# Altium schematic sheet AdControl.SchDoc: AdControl
size OrCAD B; Revision: V0.1; SheetNumber: 1; SheetTotal: 1; Email: qanpan.lo@gmail.com
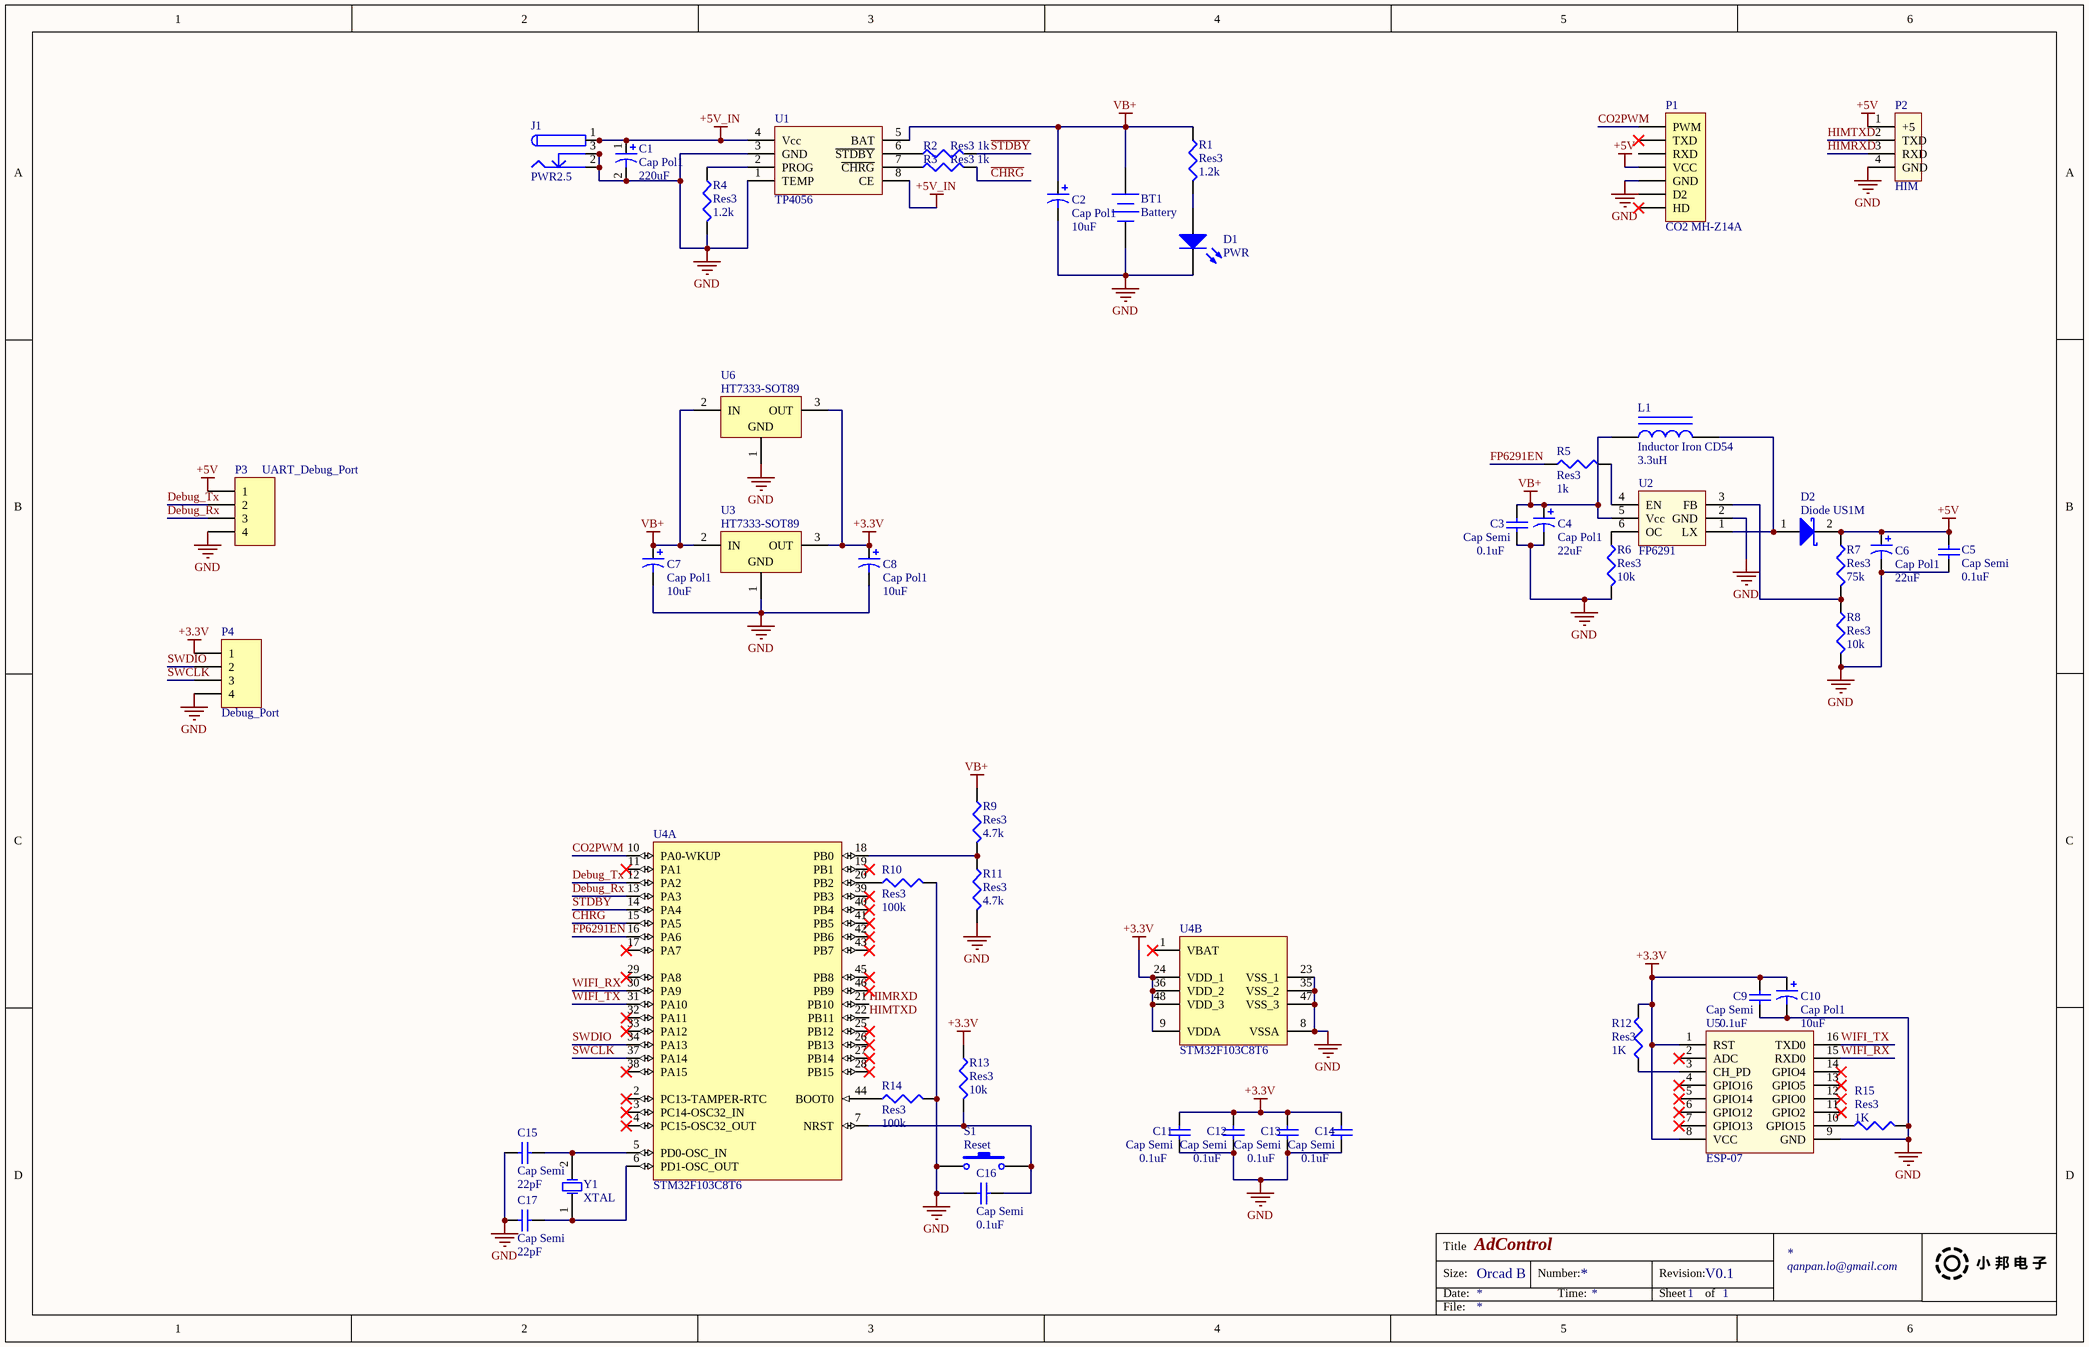
[diagram p0: AdControl.SchDoc]

## Parts
BT1  Battery  [KF3.96_2P]
C1  Cap Pol1  value 220uF  [CAP_6.3*5.4MM]
C2  Cap Pol1  value 10uF  [Cap_5*4mm]
C3  Cap Semi  value 0.1uF  [6-0805_N]
C4  Cap Pol1  value 22uF  [Cap_5*4mm]
C5  Cap Semi  value 0.1uF  [6-0805_N]
C6  Cap Pol1  value 22uF  [Cap_5*4mm]
C7  Cap Pol1  value 10uF  [Cap_5*4mm]
C8  Cap Pol1  value 10uF  [Cap_5*4mm]
C9  Cap Semi  value 0.1uF  [6-0805_N]
C10  Cap Pol1  value 10uF  [Cap_5*4mm]
C11  Cap Semi  value 0.1uF  [6-0805_N]
C12  Cap Semi  value 0.1uF  [6-0805_N]
C13  Cap Semi  value 0.1uF  [6-0805_N]
C14  Cap Semi  value 0.1uF  [6-0805_N]
C15  Cap Semi  value 22pF  [6-0805_N]
C16  Cap Semi  value 0.1uF  [6-0805_N]
C17  Cap Semi  value 22pF  [6-0805_N]
D1  PWR  [6-0805_N]
D2  Diode US1M  [US1M]
J1  PWR2.5  [KLD-3.5-1.3mm]
L1  Inductor Iron CD54  value 3.3uH  [CD54_Inductor]
P1  CO2 MH-Z14A  [1.25Connector]
P2  HIM  [XH2.54-4P]
P3  UART_Debug_Port  [HDR1X4]
P4  Debug_Port  [HDR1X4]
R1  Res3  value 1.2k  [6-0805_N]
R2  Res3  value 1k  [6-0805_N]
R3  Res3  value 1k  [6-0805_N]
R4  Res3  value 1.2k  [6-0805_N]
R5  Res3  value 1k  [6-0805_N]
R6  Res3  value 10k  [6-0805_N]
R7  Res3  value 75k  [6-0805_N]
R8  Res3  value 10k  [6-0805_N]
R9  Res3  value 4.7k  [6-0805_N]
R10  Res3  value 100k  [6-0805_N]
R11  Res3  value 4.7k  [6-0805_N]
R12  Res3  value 1K  [6-0805_N]
R13  Res3  value 10k  [6-0805_N]
R14  Res3  value 100k  [6-0805_N]
R15  Res3  value 1K  [6-0805_N]
S1  Reset  [SWP_PB_6.5mm]
U1  TP4056  [Power_SOP8]
U2  FP6291  [SOT23-6L]
U3  HT7333-SOT89  [SOT89_N]
U4  STM32F103C8T6  [STM-LQFP48_L]  (parts A,B of 2)
U5  ESP-07  [ESP-07_Wifi]
U6  HT7333-SOT89  [SOT89_N]
Y1  XTAL  [OSC_5032_2Pin]

## Nets
+3.3V: C8.1 C9.1 C10.1 C11.1 C12.1 C13.1 C14.1 P4.1 R12.2 R13.1 U3.3(OUT) U4.9(VDDA) U4.24(VDD_1) U4.36(VDD_2) U4.48(VDD_3) U5.1(RST) U5.8(VCC) U6.3(OUT)
+5V: C5.1 C6.1 D2.2(K) P1.4(VCC) P2.1(+5) P3.1 R7.1
+5V_IN: C1.1 J1.1 J1.1A J1.1B U1.4(Vcc) U1.8(CE)
GND: BT1.2(-) C1.2 C2.2 C3.2 C4.2 C5.2 C6.2 C7.2 C8.2 C9.2 C10.2 C11.2 C12.2 C13.2 C14.2 C15.2 C16.1 C17.2 D1.2(K) J1.2 J1.2A J1.2B J1.3 J1.3A J1.3B P1.5(GND) P2.4(GND) P3.4 P4.4 R4.2 R6.2 R8.2 R10.2 R11.2 R14.2 R15.2 S1.1 U1.1(TEMP) U1.3(GND) U2.2(GND) U3.1(GND) U4.8(VSSA) U4.23(VSS_1) U4.35(VSS_2) U4.47(VSS_3) U5.9(GND) U6.1(GND)
VB+: BT1.1(+) C2.1 C3.1 C4.1 C7.1 L1.1 R1.1 R9.1 U1.5(BAT) U2.5(Vcc) U3.2(IN) U6.2(IN)
~{CHRG}: R3.2 U4.15(PA5)
CO2PWM: P1.1(PWM) U4.10(PA0-WKUP)
Debug_Rx: P3.3 U4.13(PA3)
Debug_Tx: P3.2 U4.12(PA2)
FP6291EN: R5.1 U4.16(PA6)
HIMRXD: P2.3(RXD) U4.21(PB10)
HIMTXD: P2.2(TXD) U4.22(PB11)
~{STDBY}: R2.2 U4.14(PA4)
SWCLK: P4.3 U4.37(PA14)
SWDIO: P4.2 U4.34(PA13)
WIFI_RX: U4.30(PA9) U5.15(RXD0)
WIFI_TX: U4.31(PA10) U5.16(TXD0)
NetC15_1: C15.1 U4.5(PD0-OSC_IN) Y1.2(OSC2)
NetC16_2: C16.2 R13.2 S1.2 U4.7(NRST)
NetC17_1: C17.1 U4.6(PD1-OSC_OUT) Y1.1(OSC1)
NetD1_1: D1.1(A) R1.2
NetD2_1: D2.1(A) L1.2 U2.1(LX)
NetR2_1: R2.1 U1.6(~{STDBY})
NetR3_1: R3.1 U1.7(~{CHRG})
NetR4_1: R4.1 U1.2(PROG)
NetR5_2: R5.2 U2.4(EN)
NetR6_1: R6.1 U2.6(OC)
NetR7_2: R7.2 R8.1 U2.3(FB)
NetR9_2: R9.2 R11.1 U4.18(PB0)
NetR10_1: R10.1 U4.20(PB2)
NetR12_1: R12.1 U5.3(CH_PD)
NetR14_1: R14.1 U4.44(BOOT0)
NetR15_1: R15.1 U5.10(GPIO15)

Not connected (* = marked no-connect by the designer): P1 2(TXD)* 3(RXD) 6(D2) 7(HD)*; U4 1(VBAT)* 2(PC13-TAMPER-RTC)* 3(PC14-OSC32_IN)* 4(PC15-OSC32_OUT)* 11(PA1)* 17(PA7)* 19(PB1)* 25(PB12)* 26(PB13)* 27(PB14)* 28(PB15)* 29(PA8)* 32(PA11)* 33(PA12)* 38(PA15)* 39(PB3)* 40(PB4)* 41(PB5)* 42(PB6)* 43(PB7)* 45(PB8)* 46(PB9)*; U5 2(ADC)* 4(GPIO16)* 5(GPIO14)* 6(GPIO12)* 7(GPIO13)* 11(GPIO2)* 12(GPIO0)* 13(GPIO5)* 14(GPIO4)*

## Notes on the sheet
- Title
- Size:
- Date:
- Orcad B
- Number:
- Time:
- Revision:
- Sheet
- of
- File:

## Library data of the parts
BT1 = Battery: Multicell Battery; Published: 24-Mar-1999; LatestRevisionDate: 17-Jul-2002; LatestRevisionNote: Re-released for DXP Platform.; PackageReference: BAT-2; Publisher: Altium Limited; PackageDescription: Battery; 2 Leads
C1 C2 C4 C6-C8 C10 = Cap Pol1: Polarized Capacitor (Radial); Published: 8-Jun-2000; LatestRevisionDate: 17-Jul-2002; LatestRevisionNote: Re-released for DXP Platform.; PackageReference: RB7.6-15; Publisher: Altium Limited; PackageDescription: Polarized Capacitor (Radial); 2 Leads
C3 C5 C9 C11-C17 = Cap Semi: Capacitor (Semiconductor SIM Model); Published: 8-Jun-2000; LatestRevisionDate: 29-May-2009; LatestRevisionNote: IPC-7351 Footprint Added.; PackageReference: C1206; Publisher: Altium Limited; PackageDescription: Chip Capacitor
D1 = LED0: Typical INFRARED GaAs LED; Published: 8-Jun-2000; LatestRevisionDate: 08-Jul-2005; LatestRevisionNote: Mech Layer 1 removed.; PackageReference: LED-0; Publisher: Altium Limited; PackageDescription: LED; 2 Leads
D2 = Diode BAT17: Silicon RF Schottky Diode for Mixer Applications in the VHF/UHF Range; Note: Pin 2 is not connected and not drawn.; Published: 21-Mar-2003; LatestRevisionDate: 29-May-2009; LatestRevisionNote: IPC-7351 Footprint Added.; DatasheetVersion: Oct-1999; PackageVersion: Sep-2001; PackageReference: SOT-23; Publisher: Altium Limited; PackageDescription: 3-Pin SOT-23 Package 0.95 mm Pitch, 2.5 mm Lead Span; ComponentLink1Description: Manufacturer Link; ComponentLink1URL: http://www.infineon.com/; ComponentLink2Description: Datasheet; ComponentLink2URL: http://www.infineon.com/upload/Document/cmc_upload/documents/009/363/bat17series.pdf
J1 = PWR2.5: Low Voltage Power Supply Connector; Published: 17-Dec-2003; DatasheetDocument: 09-May-2002; Publisher: Altium Limited; ComponentLink1Description: Manufacturer Link; ComponentLink1URL: http://domino.kycon.com/internet/Products.html
L1 = Inductor Iron: Magnetic-Core Inductor; Published: 24-Mar-1999; LatestRevisionDate: 17-Jul-2002; LatestRevisionNote: Re-released for DXP Platform.; PackageReference: AXIAL-0.9; Publisher: Altium Limited; PackageDescription: Axial Device, Thru-Hole; 2 Leads; 0.9 in Pin Spacing
P1 = Header 7: Header, 7-Pin; LatestRevisionDate: 17-Jul-2002; LatestRevisionNote: Re-released for DXP Platform.; Publisher: Altium Limited
P2 = XH2.54-4P
P3 P4 = Header 4: Header, 4-Pin; LatestRevisionDate: 17-Jul-2002; LatestRevisionNote: Re-released for DXP Platform.; Publisher: Altium Limited
R1-R15 = Res3: Resistor; Published: 8-Jun-2000; LatestRevisionDate: 29-May-2009; LatestRevisionNote: IPC-7351 Footprint Added.; PackageReference: J1-0603; Publisher: Altium Limited; PackageDescription: Chip Resistor
S1 = SW-PB: Switch; Published: 24-Mar-1999; LatestRevisionDate: 17-Jul-2002; LatestRevisionNote: Re-released for DXP Platform.; PackageReference: SPST-2; Publisher: Altium Limited; PackageDescription: Switch; 2 Leads
U3 U6 = CMP-0204-00157-1: Low Power Consumption LDO, Output Voltage 3.3V, SOT89 Pkg; DatasheetVersion: Rev1.4, Jan-2006; PackageVersion: May-2010; PackageReference: SOT89; Code_IPC: SOT89; PackageDescription: 3-Pin SOT-89 Package 1.5 mm Pitch, 4.1 mm Lead Span
U4 = CMP-0237-00215-3: ARM Cortex-M3 32-bit MCU, 64 KB Flash, 20 KB Internal RAM, 37 I/Os, 48-pin LQFP, -40 to 85 degC, Tray; Supply Voltage(Vcc) min (V): 2; Internal RAM Size (kB): 20; FLASH Size (Prog) (kB): 64; A/D Converter: 2x12-bit (10 Channel); I/Os (High Current): 37; Operating Frequency(F) (Processor speed) (MHz): 72; Core: ARM Cortex-M3; ComponentLink3Description: Package Specification; Mounting Technology: Surface Mount; PartNumber: STM32F103C8T6; PackageReference: LQFP48; Packing: Tray; ComponentLink3URL: http://www.st.com/st-web-ui/static/active/en/resource/technical/document/datasheet/DM00058181.pdf; DatasheetVersion: Rev. 16; ComponentLink1URL: http://www.st.com/web/en/home.html; PackageVersion: Rev. 6, 06/2013; ComponentLink2URL: http://www.st.com/st-web-ui/static/active/en/resource/technical/document/datasheet/CD00161566.pdf; ComponentLink1Description: Manufacturer URL; ComponentLink2Description: Datasheet; PackageDescription: 48-Pin Low Profile Quad Flat Package, 7 x 7 mm Body, 0.5 mm Pitch
U5 = ESP-07_Wifi
Y1 = XTAL: Crystal Oscillator; Published: 8-Jun-2000; LatestRevisionDate: 17-Jul-2002; LatestRevisionNote: Re-released for DXP Platform.; PackageReference: R38; Publisher: Altium Limited; PackageDescription: Crystal, Thru-Hole; 2 Leads; Body 3.1 x 8.2 mm (Dia.xH)